# EAGLE design Main_board (EAGLE 6.3)
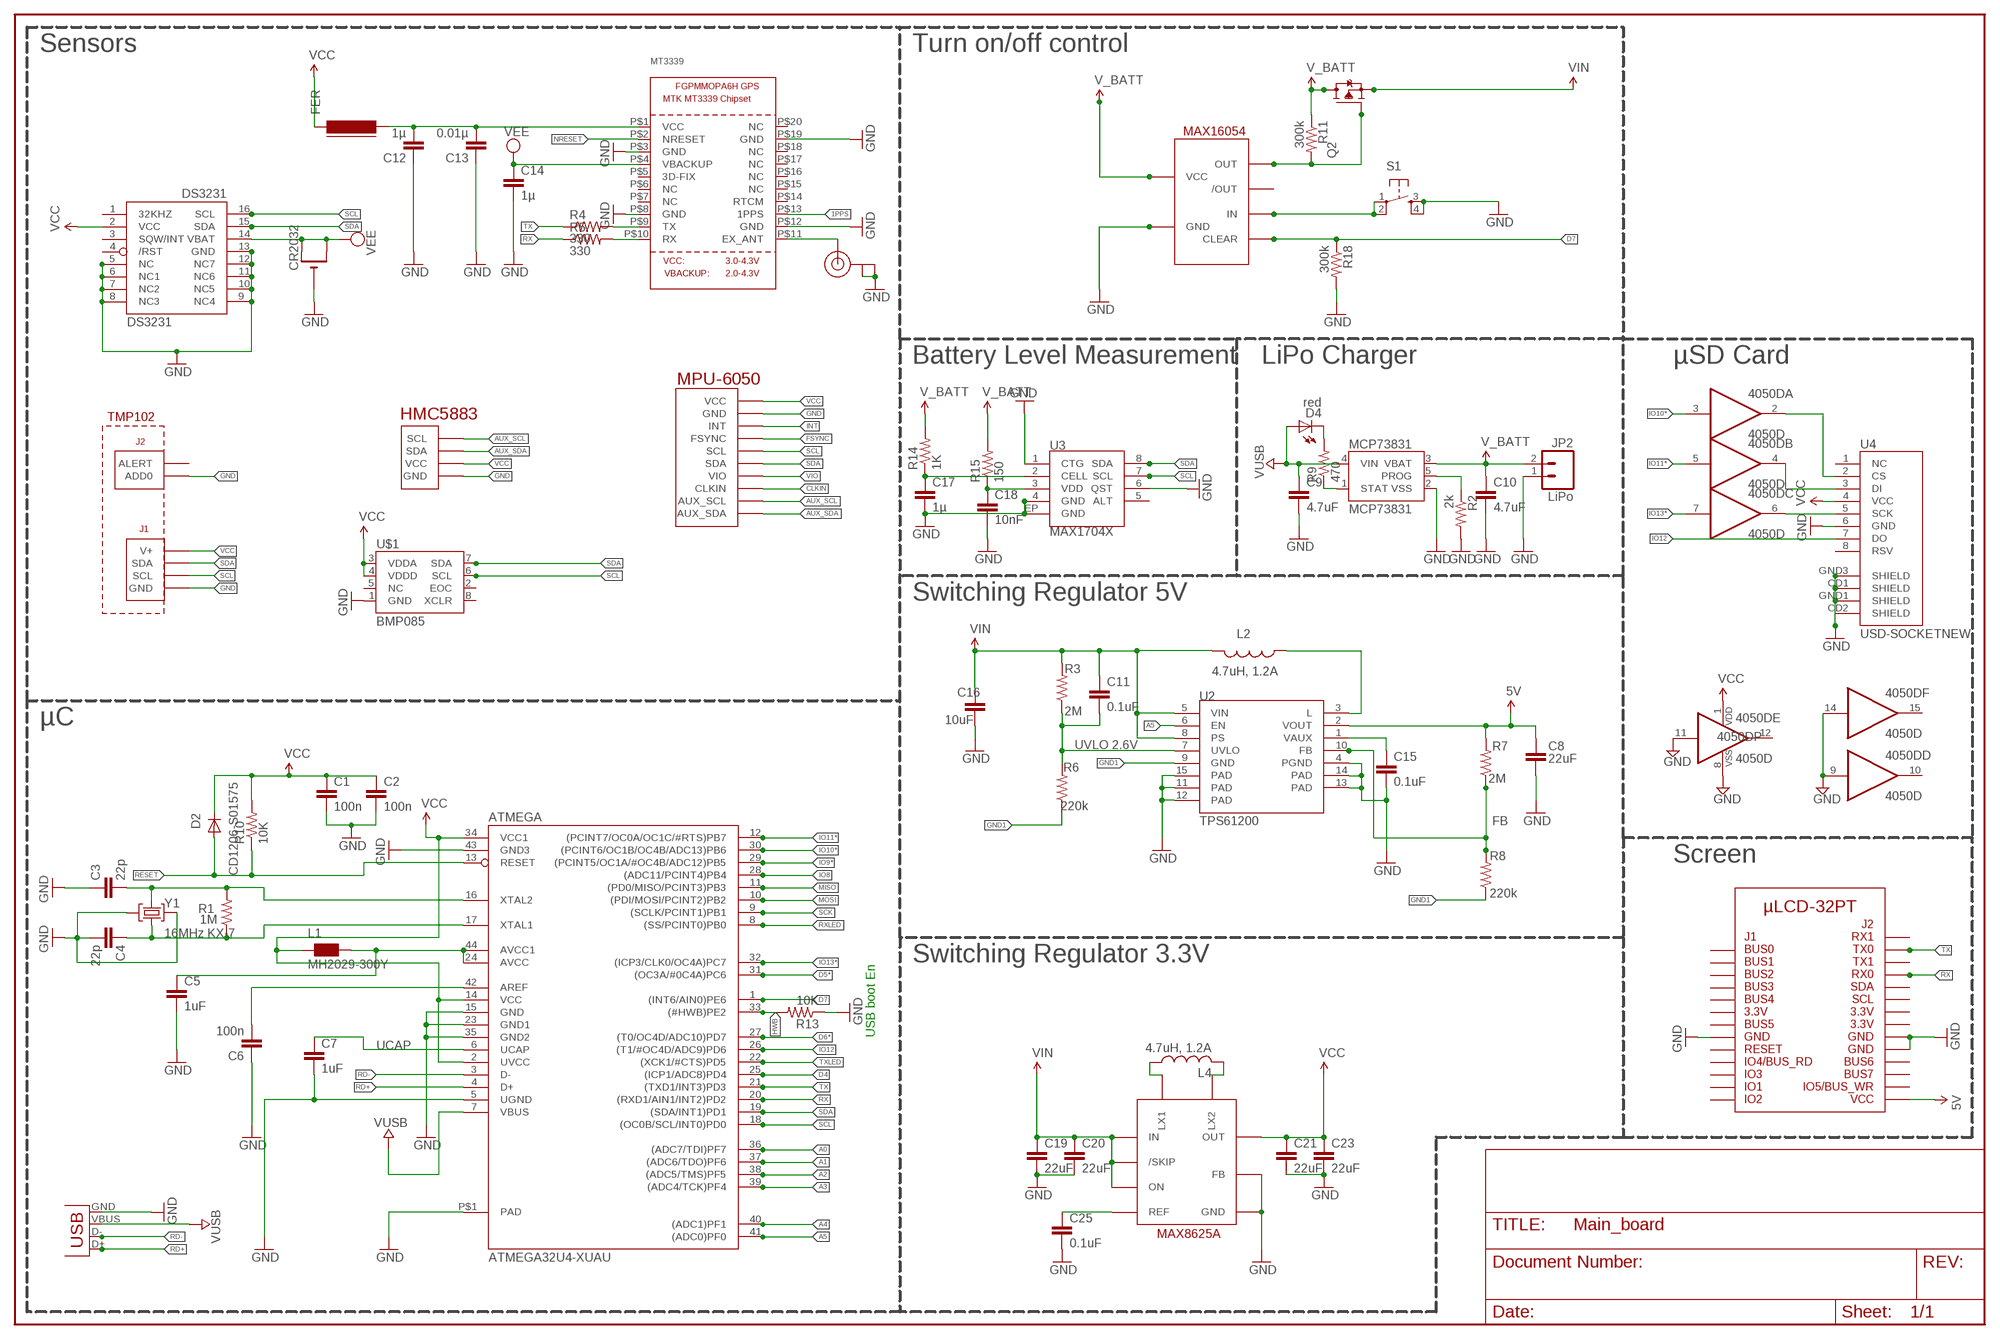
[diagram p0: schematic, sheet 1]

## Parts
4050D  4050D  [SO16]
ATMEGA  ATMEGA32U4-XUAU  [TQFP44-PAD]
C1  100n  CAP0805  [0805]
C2  100n  CAP0805  [0805]
C3  22p  CAP0805  [0805]
C4  22p  CAP0805  [0805]
C5  1uF  CAP0805  [0805]
C6  100n  CAP0805  [0805]
C7  1uF  CAP0805  [0805]
C8  22uF  CAP0805  [0805]
C9  4.7uF  CAP0805  [0805]
C10  4.7uF  CAP0805  [0805]
C11  0.1uF  CAP0805  [0805]
C12  1µ  CAP0805  [0805]
C13  0.01µ  CAP0805  [0805]
C14  1µ  CAP0805  [0805]
C15  0.1uF  CAP0805  [0805]
C16  10uF  CAP0805  [0805]
C17  1µ  CAP0805  [0805]
C18  10nF  CAP0805  [0805]
C19  22uF  CAP0805  [0805]
C20  22uF  CAP0805  [0805]
C21  22uF  CAP0805  [0805]
C23  22uF  CAP0805  [0805]
C25  0.1uF  CAP0805  [0805]
CR2032  CR2032SMT  [CR2032-SMD]
D2  CD1206-S01575  DIODE-MINIMELF  [MINIMELF]
D4  red  LED1206  [LED-1206]
DS3231  DS3231/SO  [SO16W]
FER  FERRITE-1206  [FB1206]
JP2  LiPo  M02-JST-2MM-SMT  [JST-2-SMD]
L1  MH2029-300Y  WE-CBF_0805  [0805]
L2  4.7uH, 1.2A  L-US  [2520]
L4  4.7uH, 1.2A  L-US  [2520]
MAX16054  MAX16054  [SOT23-6L]
MCP73831  MCP73831  [SOT23-5]
MT3339  GPS_FGPMMOPA6H  [FGPMMOPA6H]
Q2  TRANSISTOR_FET_TSM2301CX  [SOT-23]
R1  1M  RESISTOR0805-RES  [0805]
R2  2k  RESISTOR0805-RES  [0805]
R3  2M  RESISTOR0805-RES  [0805]
R4  330  RESISTOR0805-RES  [0805]
R5  330  RESISTOR0805-RES  [0805]
R6  220k  RESISTOR0805-RES  [0805]
R7  2M  RESISTOR0805-RES  [0805]
R8  220k  RESISTOR0805-RES  [0805]
R9  470  RESISTOR0805-RES  [0805]
R10  10K  RESISTOR0805-RES  [0805]
R11  300k  RESISTOR0805-RES  [0805]
R13  10K  RESISTOR0805-RES  [0805]
R14  1K  RESISTOR0805-RES  [0805]
R15  150  RESISTOR0805-RES  [0805]
R18  300k  RESISTOR0805-RES  [0805]
S1  TAC_SWITCHSMD  [TACTILE_SWITCH_SMD]
U2  TPS61200  [QFN-10_PAD]
U3  MAX1704X  [TDFN-8]
U4  USD-SOCKETNEW  [MICRO-SD-SOCKET-PP]
U$1  BMP085  [BMP085]
U$2  µLCD-32PT  [µLCD-32PT]
U$3  U.FL  [U.FL]
U$6  HMC5883  [HMC5883]
U$7  MPU-6050  [MPU-6050]
U$8  TMP102  [TMP102]
U$9  MAX8625A  [14-TDFN-EP]
X1  USB-MICROB  [USB-MICROB]
Y1  16MHz KX-7  CRYSTAL-3.2-2.5  [CRYSTAL-3.2-2.5]

## Nets
1PPS: MT3339.P$13(1PPS)
5V: C8.1 R7.2 U2.2(VOUT) U$2.J2-P6
A0: ATMEGA.36((ADC7/TDI)PF7)
A1: ATMEGA.37((ADC6/TDO)PF6)
A2: ATMEGA.38((ADC5/TMS)PF5)
A3: ATMEGA.39((ADC4/TCK)PF4)
A4: ATMEGA.40((ADC1)PF1)
A5: ATMEGA.41((ADC0)PF0) U2.6(EN)
AREF: ATMEGA.42(AREF) C6.2
AUX_SCL: U$6.SCL U$7.AUX_SCL
AUX_SDA: U$6.SDA U$7.AUX_SDA
AVCC: ATMEGA.24(AVCC) ATMEGA.44(AVCC1) C5.1 L1.2
CLKIN: U$7.CLK(CLKIN)
D4: ATMEGA.25((ICP1/ADC8)PD4)
D5*: ATMEGA.31((OC3A/#0C4A)PC6)
D6*: ATMEGA.27((T0/OC4D/ADC10)PD7)
D7: ATMEGA.1((INT6/AIN0)PE6) MAX16054.3(CLEAR) R18.1
FB: R7.1 R8.2 U2.10(FB)
FSYNC: U$7.FSYNC
GND: 4050D.8(P:VSS) 4050D.9(D:I) 4050D.11(E:I) 4050D.14(F:I) ATMEGA.5(UGND) ATMEGA.15(GND) ATMEGA.23(GND1) ATMEGA.35(GND2) ATMEGA.43(GND3) ATMEGA.P$1(PAD) C1.2 C2.2 C3.1 C4.2 C5.2 C6.1 C7.2 C8.2 C9.2 C10.2 C12.1 C13.1 C14.2 C15.2 C16.2 C17.2 C18.2 C19.2 C20.2 C21.2 C23.2 C25.2 CR2032.- DS3231.5(NC) DS3231.6(NC1) DS3231.7(NC2) DS3231.8(NC3) DS3231.9(NC4) DS3231.10(NC5) DS3231.11(NC6) DS3231.12(NC7) DS3231.13(GND) JP2.1 MAX16054.2(GND) MCP73831.2(VSS) MT3339.P$3(GND) MT3339.P$8(GND) MT3339.P$12(GND) MT3339.P$19(GND) R2.2 R13.1 R18.2 S1.3 S1.4 U2.4(PGND) U2.11(PAD) U2.12(PAD) U2.13(PAD) U2.14(PAD) U2.15(PAD) U3.1(CTG) U3.4(GND) U3.6(QST) U3.EP(GND) U4.6(GND) U4.CD1(SHIELD) U4.CD2(SHIELD) U4.GND1(SHIELD) U4.GND3(SHIELD) U$1.1(GND) U$2.J1-P15 U$2.J2-P15 U$2.J2-P17 U$3.P$1(GND) U$3.P$2(GND) U$6.GND U$7.GND U$8.ADD0 U$8.GND U$9.P$8(FB) U$9.P$12(GND) U$9.P$13(GND) X1.GND Y1.2(GND) Y1.4(GND)
GND1: R6.1 R8.1 U2.9(GND)
HWB: ATMEGA.33((#HWB)PE2) R13.2
INT: U$7.INT
IO8: ATMEGA.28((ADC11/PCINT4)PB4)
IO9*: ATMEGA.29((PCINT5/OC1A/#OC4B/ADC12)PB5)
IO10*: 4050D.3(A:I) ATMEGA.30((PCINT6/OC1B/OC4B/ADC13)PB6)
IO11*: 4050D.5(B:I) ATMEGA.12((PCINT7/OC0A/OC1C/#RTS)PB7)
IO12: ATMEGA.26((T1/#OC4D/ADC9)PD6) U4.7(DO)
IO13*: 4050D.7(C:I) ATMEGA.32((ICP3/CLK0/OC4A)PC7)
MISO: ATMEGA.11((PD0/MISO/PCINT3)PB3)
MOSI: ATMEGA.10((PDI/MOSI/PCINT2)PB2)
N$1: MT3339.P$11(EX_ANT) U$3.P$3(SIGNAL)
N$2: D4.C R9.2
N$3: L2.P$1 U2.3(L)
N$4: C15.1 U2.1(VAUX)
N$5: C17.1 R14.1 U3.2(CELL)
N$6: 4050D.4(B:O) U4.3(DI)
N$7: MT3339.P$9(TX) R4.2
N$8: MT3339.P$10(RX) R5.2
N$9: C12.2 C13.2 FER.2 MT3339.P$1(VCC)
N$10: C18.1 R15.1 U3.3(VDD)
N$11: MCP73831.5(PROG) R2.1
N$12: 4050D.6(C:O) U4.5(SCK)
N$13: 4050D.2(A:O) U4.2(CS)
N$14: MCP73831.1(STAT) R9.1
N$15: MAX16054.1(IN) S1.1 S1.2
N$22: C25.1 U$9.P$9(REF)
N$23: L4.P$1 U$9.P$2(LX1) U$9.P$3(LX1)
N$24: L4.P$2 U$9.P$4(LX2) U$9.P$5(LX2)
NRESET: MT3339.P$2(NRESET)
RD+: ATMEGA.4(D+) X1.D+
RD-: ATMEGA.3(D-) X1.D-
RESET: ATMEGA.13(RESET) D2.A R10.1
RX: ATMEGA.20((RXD1/AIN1/INT2)PD2) R5.1 U$2.J2-P27
RXLED: ATMEGA.8((SS/PCINT0)PB0)
SCK: ATMEGA.9((SCLK/PCINT1)PB1)
SCL: ATMEGA.18((OC0B/SCL/INT0)PD0) DS3231.16(SCL) U3.7(SCL) U$1.6(SCL) U$7.SCL U$8.SCL
SDA: ATMEGA.19((SDA/INT1)PD1) DS3231.15(SDA) U3.8(SDA) U$1.7(SDA) U$7.SDA U$8.SDA
TX: ATMEGA.21((TXD1/INT3)PD3) R4.1 U$2.J2-P29
TXLED: ATMEGA.22((XCK1/#CTS)PD5)
UCAP: ATMEGA.6(UCAP) C7.1
UVLO: C11.2 R3.1 R6.2 U2.7(UVLO)
V_BATT: C10.1 JP2.2 MAX16054.6(VCC) MCP73831.3(VBAT) Q2.3(D) R11.1 R14.2 R15.2
V_CTRL: MAX16054.5(OUT) Q2.1(G) R11.2
VCC: 4050D.1(P:VDD) ATMEGA.2(UVCC) ATMEGA.14(VCC) ATMEGA.34(VCC1) C1.1 C2.1 C21.1 C23.1 D2.C DS3231.2(VCC) FER.1 L1.1 R10.2 U4.4(VCC) U$1.3(VDDA) U$1.4(VDDD) U$6.VCC U$7.VDD(VCC) U$8.V+ U$9.P$10(OUT) U$9.P$11(OUT)
VEE: C14.1 CR2032.+$1(+) CR2032.+$2(+1) DS3231.14(VBAT) MT3339.P$4(VBACKUP)
VIN: C11.1 C16.1 C19.1 C20.1 L2.P$2 Q2.2(S) R3.2 U2.5(VIN) U2.8(PS) U$9.P$6(ON) U$9.P$7(/SKIP) U$9.P$14(IN) U$9.P$15(IN)
VIO: U$7.VIO
VUSB: ATMEGA.7(VBUS) C9.1 D4.A MCP73831.4(VIN) X1.VBUS
XTAL1: ATMEGA.17(XTAL1) C4.1 R1.1 Y1.1(C1)
XTAL2: ATMEGA.16(XTAL2) C3.2 R1.2 Y1.3(C2)
Unconnected: 4050D.10(D:O) 4050D.12(E:O) 4050D.15(F:O) DS3231.1(32KHZ) DS3231.3(SQW/INT) DS3231.4(/RST) MAX16054.4(/OUT) MT3339.P$5(3D-FIX) MT3339.P$6(NC) MT3339.P$7(NC) MT3339.P$14(RTCM) MT3339.P$15(NC) MT3339.P$16(NC) MT3339.P$17(NC) MT3339.P$18(NC) MT3339.P$20(NC) U3.5(ALT) U4.1(NC) U4.8(RSV) U$1.2(EOC) U$1.5(NC) U$1.8(XCLR) U$2.J1-P1 U$2.J1-P2 U$2.J1-P3 U$2.J1-P5 U$2.J1-P14 U$2.J1-P17 U$2.J1-P19 U$2.J1-P21 U$2.J1-P23 U$2.J1-P25 U$2.J1-P27 U$2.J2-P9 U$2.J2-P11 U$2.J2-P13 U$2.J2-P21 U$2.J2-P23 U$2.J2-P28 U$2.J2-P30 U$8.ALT(ALERT)

## Notes on the sheet
- Sensors | Turn on/off control
- Battery Level Measurement | LiPo Charger | µSD Card
- Switching Regulator 5V
- µC
- UVLO 2.6V
- Screen
- Switching Regulator 3.3V
- USB boot En

## Power pins joined to a net without a drawn wire
J1-P18: U$2.J1-P18
J2-P16: U$2.J2-P16
J2-P18: U$2.J2-P18

## Library data of the parts
4050D = 40xx:4050: Hex non-inverting BUFFER
ATMEGA = SmartPrj:ATMEGA32U4-XU
C1-C21 C23 C25 = SparkFun:CAP: Capacitor Standard 0603 ceramic capacitor, and 0.1" leaded capacitor.
CR2032 = adafruit:CR2032
D2 = diode:DIODE-: DIODE
D4 = SparkFun:LED: LEDs Standard schematic elements and footprints for 5mm, 3mm, 1206, and 0603 sized LEDs. 5mm - Spark Fun Electronics SKU : COM-00529 (and others)
DS3231 = adafruit:DS3231
FER = dp_devices:FERRITE: Ferrite bead in various packages
JP2 = SparkFun:M02: Header 2 Standard 2-pin 0.1" header. Use with straight break away headers (SKU : PRT-00116), right angle break away headers (PRT-00553), swiss pins (PRT-00743), machine pins (PRT-00117), and female headers (PRT-00115). Molex polarized connector foot print use with SKU : PRT-08233 with associated crimp pins and housings.
L1 = wuerth-elektronik:WE-CBF: SMD EMI Suppression Ferrite Beads - excellent anti-EMI properties - low DCR - impedances till 3000 ohms - rated current up to 6 A
L2 L4 = rcl:L-US: INDUCTOR, American symbol
MAX16054 = maxim:MAX16054
MCP73831 = SparkFun:MCP73831: Microchip's MCP73831 Miniature single cell, fully integrated Li-Ion, Li-polymer charge management controller http://ww1.microchip.com/downloads/en/DeviceDoc/21984a.pdf
MT3339 = adafruit:GPS_FGPMMOPA6H: GPS Module - MTK MT3339 Chipset, -165dBm sensitivity, 22 channels, 10Hz, auto-select external antenna options
Q2 = dp_devices:TRANSISTOR_FET_TSM2301CX: 20V P-Channel Enhancement Mode MOSFET
R1-R10 R13-R15 = SparkFun:RESISTOR: Resistor Basic schematic elements and footprints for 0603, 1206, and PTH resistors.
R11 R18 = SparkFun-Passives:RESISTOR: Resistor Basic schematic elements and footprints for 0603, 1206, and PTH resistors.
S1 = SparkFun-Electromechanical:TAC_SWITCH: Momentary Switch Button commonly used for reset or general input. Spark Fun Electronics SKU : COM-00097 SMT- SWCH-08247; PROD_ID: SWCH-08247
U2 = SparkFun:TPS61200: DC to DC Booster
U3 = SparkFun-PowerIC:MAX1704X: MAX17043/MAX17044: Battery Fuel Guage (43 is 1cell, 44 is 2cell)
U4 = SparkFun-Connectors:USD-SOCKET: microSD Socket Push-push type uSD socket. Schematic element and footprint production proven. Spark Fun Electronics SKU : PRT-00127. tDoc lines correctly indicate media card edge positions when inserting (unlocked, locked, depressed).
U$1 = SparkFun:BMP085: BMP085 Pressure Sensor Great little MEMS pressure sensor. SKU: COM-09603
U$2 = 4DSystems:µLCD-32PT
U$3 = SparkFun:U.FL
U$6 = SparkFun-Breakouts:HMC5883: HMC5883 On breakout from SparkFun SFU:SEN-10530
U$7 = SparkFun-Breakouts:MPU-6050: MPU-6050 Breakout board from SparkFun SFU:SEN-11028
U$8 = SparkFun-Breakouts:TMP102: TMP102 Breakout from SparkFun SFU:SEN-09418
U$9 = maxim:MAX8625A: High-Efficiency, Seamless Transition, Step-Up/Down DC-DC Converter
X1 = SparkFun:USB: USB Connectors USB-B-PTH is fully proven SKU : PRT-00139 USB-miniB is fully proven SKU : PRT-00587 USB-A-PCB is untested. USB-A-H is throughly reviewed, but untested. Spark Fun Electronics SKU : PRT-00437 USB-B-SMT is throughly reviewed, but untested. Needs silkscreen touching up. USB-A-S has not been used/tested USB-MB-H has not been used/tested
Y1 = SmartPrj:CRYSTAL-3.2-2.5

## Board
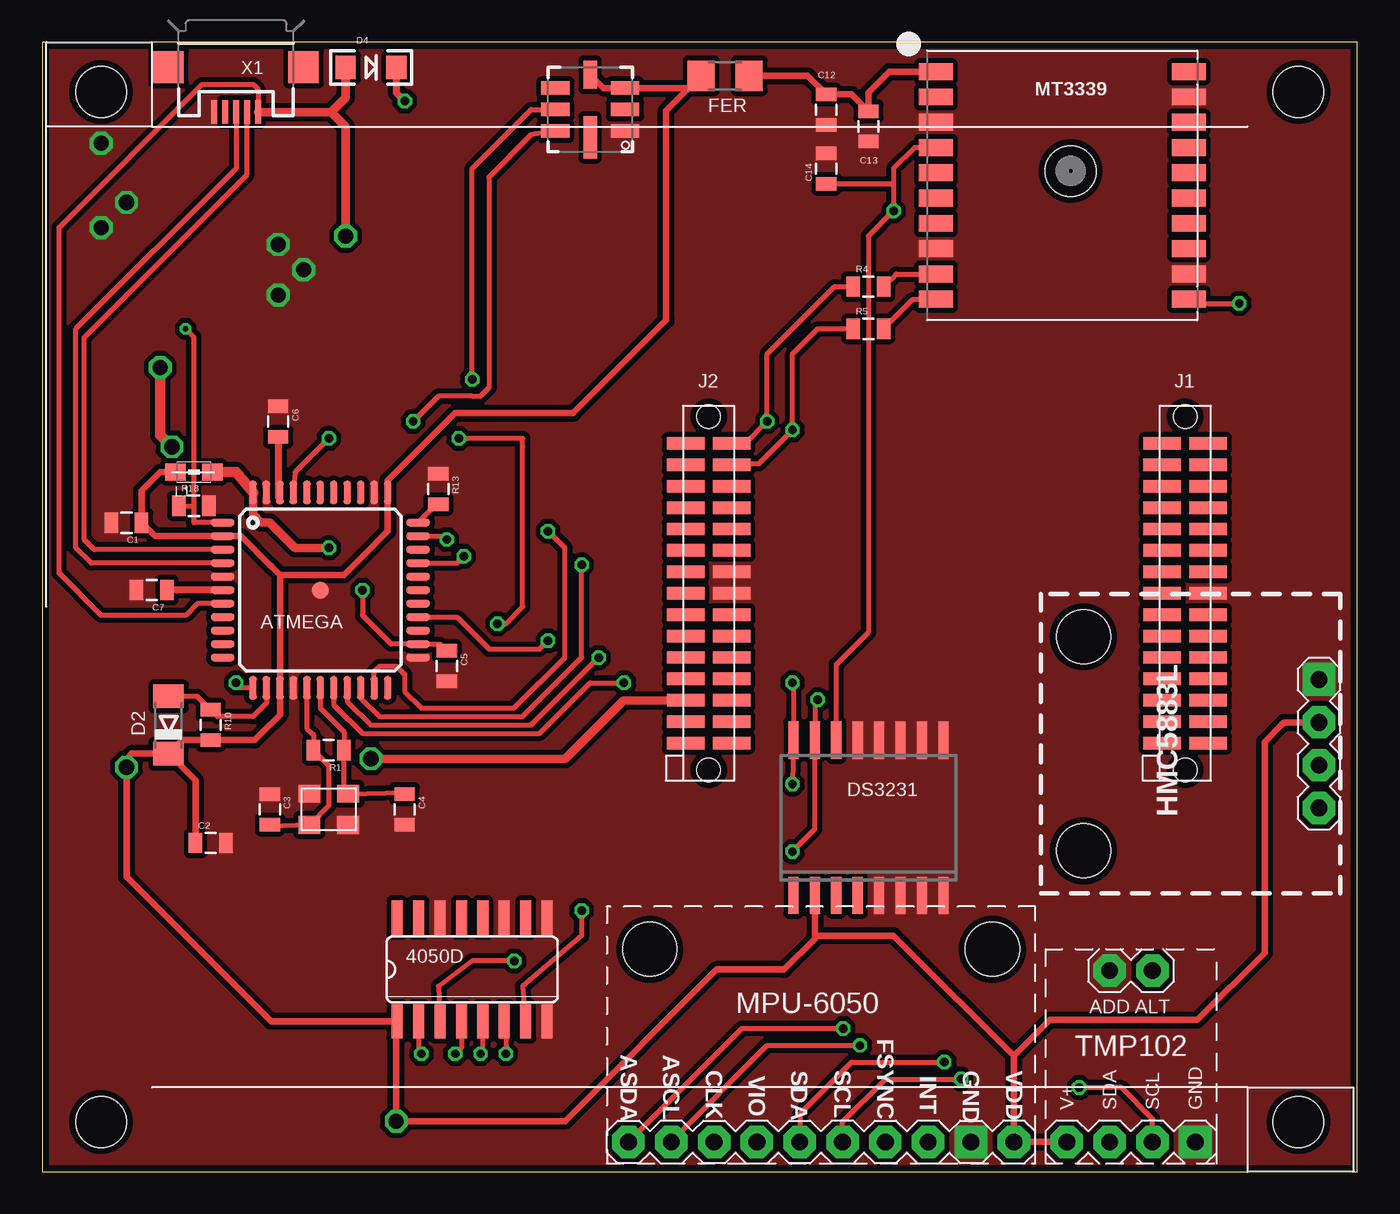
[diagram p1: board, top side]
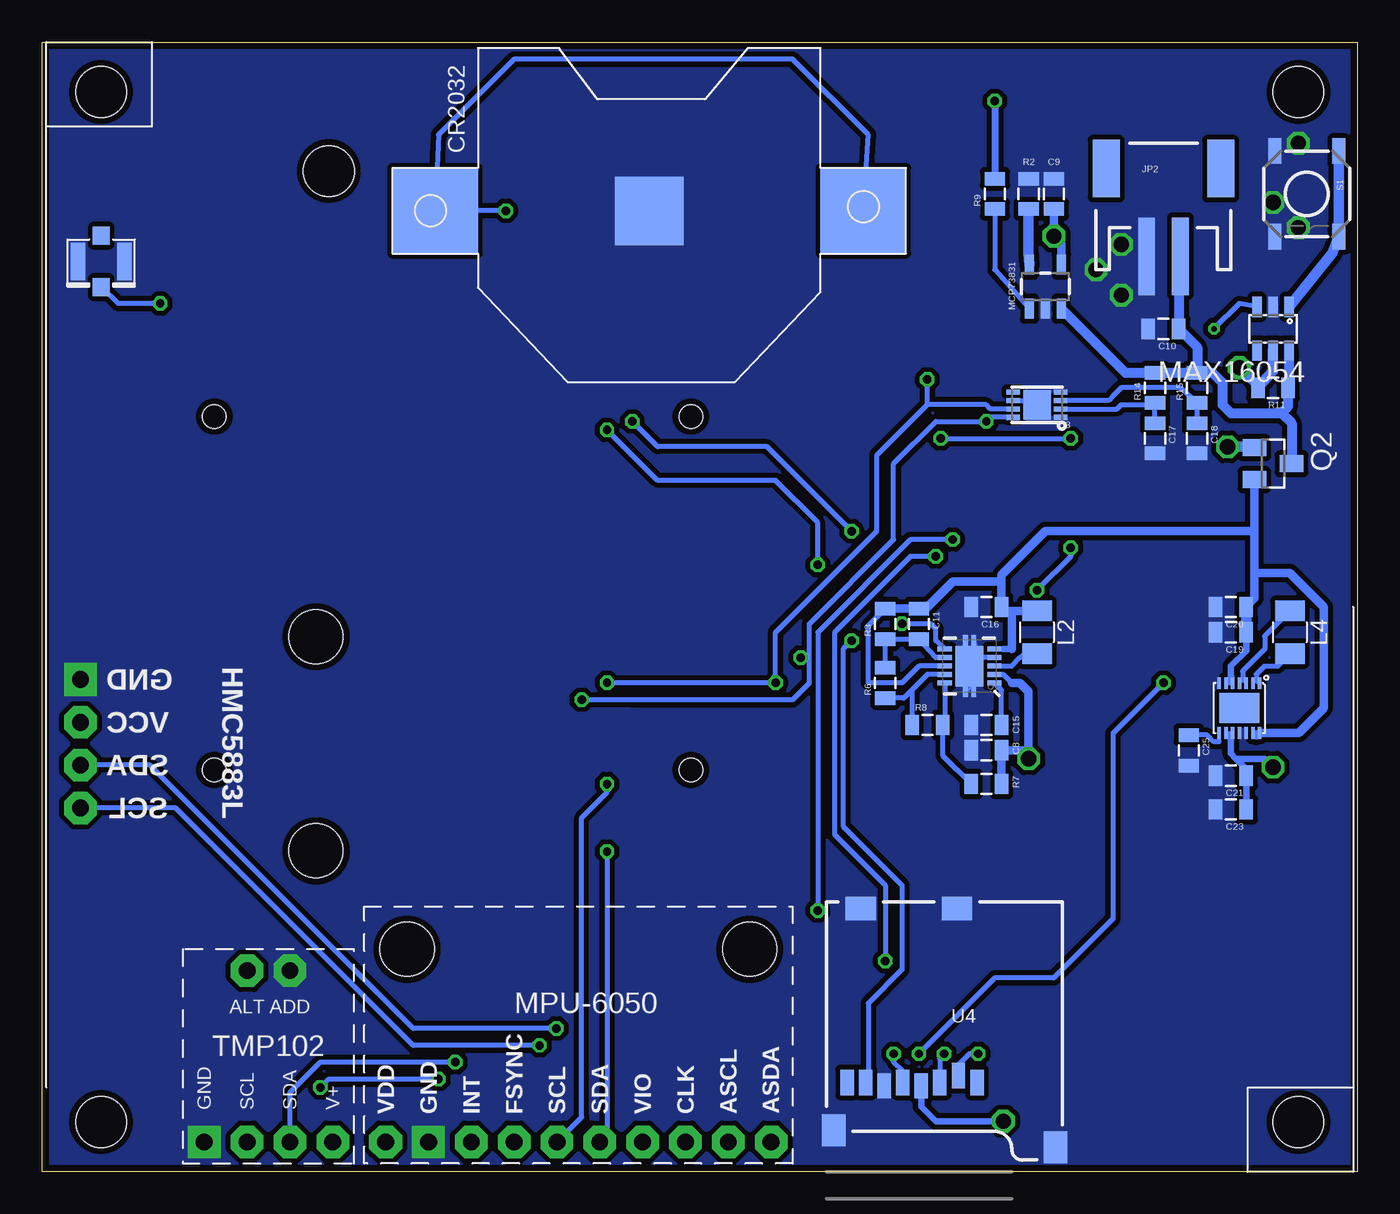
[diagram p2: board, bottom side, seen from below]

Size 78 x 67 mm. Coordinates in mm from the lower left corner, seen from the top.
Outline: 0,0 78,0 78,67 0,67 0,0
Copper layers (1*16): Top 0.0356mm / dielectric 1.5011mm / Bottom 0.0356mm
Design rules "LaenPCBOrder": minimum track width 6mil, minimum drill 13mil, track to track 6mil, track to pad 6mil, pad to pad 6mil, via to via 6mil, smd to smd 6mil, copper to edge 15mil, drill to drill 6mil, minimum pad ring 7mil, minimum via ring 7mil, stop-mask expansion 4mil, vias tented up to drill 0mil, thermal gap 10mil

### Footprints (pad centres in the part's own frame; a part is rotated, then mirrored left to right if it is on the bottom)
SO16 = smd 0.66 x 2.032: 1 -4.445,-3.073; 2 -3.175,-3.073; 3 -1.905,-3.073; 4 -0.635,-3.073; 5 0.635,-3.073; 6 1.905,-3.073; 7 3.175,-3.073; 8 4.445,-3.073; 9 4.445,3.073; 10 3.175,3.073; 11 1.905,3.073; 12 0.635,3.073; 13 -0.635,3.073; 14 -1.905,3.073; 15 -3.175,3.073; 16 -4.445,3.073
TQFP44-PAD = smd 1.4 x 0.45: 1 -5.8,4; 2 -5.8,3.2; 3 -5.8,2.4; 4 -5.8,1.6; 5 -5.8,0.8; 6 -5.8,0; 7 -5.8,-0.8; 8 -5.8,-1.6; 9 -5.8,-2.4; 10 -5.8,-3.2; 11 -5.8,-4; 23 5.8,-4; 24 5.8,-3.2; 25 5.8,-2.4; 26 5.8,-1.6; 27 5.8,-0.8; 28 5.8,0; 29 5.8,0.8; 30 5.8,1.6; 31 5.8,2.4; 32 5.8,3.2; 33 5.8,4 | smd 0.45 x 1.4: 12 -4,-5.8; 13 -3.2,-5.8; 14 -2.4,-5.8; 15 -1.6,-5.8; 16 -0.8,-5.8; 17 0,-5.8; 18 0.8,-5.8; 19 1.6,-5.8; 20 2.4,-5.8; 21 3.2,-5.8; 22 4,-5.8; 34 4,5.8; 35 3.2,5.8; 36 2.4,5.8; 37 1.6,5.8; 38 0.8,5.8; 39 0,5.8; 40 -0.8,5.8; 41 -1.6,5.8; 42 -2.4,5.8; 43 -3.2,5.8; 44 -4,5.8 | smd 1 x 1: P$1 0,0
0805 = smd 0.8 x 1.2: 1 -0.9,0; 2 0.9,0
CR2032-SMD = smd 5.08 x 5.08: +$1 -12.7,0; +$2 12.7,0 | smd 4.064 x 4.064: - 0,0
MINIMELF = smd 1.4 x 1.8: A 1.7,0; C -1.7,0
LED-1206 = smd 1.2 x 1.4: A -1.5,0; C 1.5,0
SO16W = smd 0.6 x 2.2: 1 -4.445,-4.6; 2 -3.175,-4.6; 3 -1.905,-4.6; 4 -0.635,-4.6; 5 0.635,-4.6; 6 1.905,-4.6; 7 3.175,-4.6; 8 4.445,-4.6; 9 4.445,4.6; 10 3.175,4.6; 11 1.905,4.6; 12 0.635,4.6; 13 -0.635,4.6; 14 -1.905,4.6; 15 -3.175,4.6; 16 -4.445,4.6
FB1206 = smd 1.6 x 1.803: 1 -1.422,0; 2 1.422,0
JST-2-SMD = smd 1 x 4.6: 1 -1,-3.7; 2 1,-3.7 | smd 1.6 x 3.4: NC1 -3.4,1.5; NC2 3.4,1.5
0805' = smd 1.2 x 1: 1 -1.1,0; 2 1.1,0
2520 = smd 1.2 x 1.75: P$1 1.275,0; P$2 -1.275,0
SOT23-6L = smd 0.55 x 1.2: 1 -0.95,-1.3; 2 0,-1.3; 3 0.95,-1.3; 4 0.95,1.3; 5 0,1.3; 6 -0.95,1.3
SOT23-5 = smd 0.55 x 1.2: 1 -0.95,-1.3; 2 0,-1.3; 3 0.95,-1.3; 4 0.95,1.3; 5 -0.95,1.3
FGPMMOPA6H = smd 2 x 1: P$1 -7.5,6.75; P$2 -7.5,5.25; P$3 -7.5,3.75; P$4 -7.5,2.25; P$5 -7.5,0.75; P$6 -7.5,-0.75; P$7 -7.5,-2.25; P$8 -7.5,-3.75; P$9 -7.5,-5.25; P$10 -7.5,-6.75; P$11 7.5,-6.75; P$12 7.5,-5.25; P$13 7.5,-3.75; P$14 7.5,-2.25; P$15 7.5,-0.75; P$16 7.5,0.75; P$17 7.5,2.25; P$18 7.5,3.75; P$19 7.5,5.25; P$20 7.5,6.75 | hole 3: 0.5,0.85
SOT-23 = smd 1 x 1.4: 1 -0.95,-1.1; 2 0.95,-1.1; 3 0,1.1
TACTILE_SWITCH_SMD = smd 1.524 x 0.762: 1 -2.54,1.905; 2 2.54,1.905; 3 -2.54,-1.905; 4 2.54,-1.905
QFN-10_PAD = smd 0.297 x 0.85: 1 -1,-1.475; 2 -0.5,-1.475; 3 0,-1.475; 4 0.5,-1.475; 5 1,-1.475; 6 1,1.475; 7 0.5,1.475; 8 0,1.475; 9 -0.5,1.475; 10 -1,1.475 | smd 0.7 x 0.28: 11 -1.5,0.25; 12 -1.5,-0.25; 13 1.5,0.25; 14 1.5,-0.25 | smd 2.4 x 1.65: 15 0,0
TDFN-8 = smd 0.8 x 0.3: 1 -1.4,0.75; 2 -1.4,0.25; 3 -1.4,-0.25; 4 -1.4,-0.75; 5 1.4,-0.75; 6 1.4,-0.25; 7 1.4,0.25; 8 1.4,0.75 | smd 1.63 x 1.75: EP 0,0
MICRO-SD-SOCKET-PP = smd 0.8 x 1.5: 1 -8.94,10.7; 2 -7.84,10.3; 3 -6.74,10.7; 4 -5.64,10.9; 5 -4.54,10.7; 6 -3.44,10.9; 7 -2.34,10.7; 8 -1.24,10.7 | smd 1.8 x 1.4: CD1 -2.05,0.4; CD2 -7.75,0.4 | smd 1.4 x 1.9: GND1 -13.6,14.55; GND3 -0.45,13.55
BMP085 = smd 1.67 x 0.8: 1 -2.065,1.27; 2 -2.065,0; 3 -2.065,-1.27; 5 2.065,-1.27; 6 2.065,0; 7 2.065,1.27 | smd 0.8 x 1.67: 4 0,-2.065 | smd 0.8 x 2.5: 8 0,1.65
µLCD-32PT = smd 2.223 x 0.737: J1-P1 30.16,-8.075; J1-P2 27.43,-8.075; J1-P3 30.16,-6.805; J1-P4 27.43,-6.805; J1-P5 30.16,-5.535; J1-P6 27.43,-5.535; J1-P7 30.16,-4.265; J1-P8 27.43,-4.265; J1-P9 30.16,-2.995; J1-P10 27.43,-2.995; J1-P11 30.16,-1.725; J1-P12 27.43,-1.725; J1-P13 30.16,-0.455; J1-P14 27.43,-0.455; J1-P15 30.16,0.815; J1-P16 27.43,0.815; J1-P17 30.16,2.085; J1-P18 27.43,2.085; J1-P19 30.16,3.355; J1-P20 27.43,3.355; J1-P21 30.16,4.625; J1-P22 27.43,4.625; J1-P23 30.16,5.895; J1-P24 27.43,5.895; J1-P25 30.16,7.165; J1-P26 27.43,7.165; J1-P27 30.16,8.435; J1-P28 27.43,8.435; J1-P29 30.16,9.705; J1-P30 27.43,9.705; J2-P1 1.89,-8.075; J2-P2 -0.84,-8.075; J2-P3 1.89,-6.805; J2-P4 -0.84,-6.805; J2-P5 1.89,-5.535; J2-P6 -0.84,-5.535; J2-P7 1.89,-4.265; J2-P8 -0.84,-4.265; J2-P9 1.89,-2.995; J2-P10 -0.84,-2.995; J2-P11 1.89,-1.725; J2-P12 -0.84,-1.725; J2-P13 1.89,-0.455; J2-P14 -0.84,-0.455; J2-P15 1.89,0.815; J2-P16 -0.84,0.815; J2-P17 1.89,2.085; J2-P18 -0.84,2.085; J2-P19 1.89,3.355; J2-P20 -0.84,3.355; J2-P21 1.89,4.625; J2-P22 -0.84,4.625; J2-P23 1.89,5.895; J2-P24 -0.84,5.895; J2-P25 1.89,7.165; J2-P26 -0.84,7.165; J2-P27 1.89,8.435; J2-P28 -0.84,8.435; J2-P29 1.89,9.705; J2-P30 -0.84,9.705 | hole 3: 35.5,-30.55; 35.5,30.55; -35.5,30.55; -35.5,-30.55 | hole 1.397: 28.795,-9.662; 28.795,11.293; 0.525,-9.662; 0.525,11.293
U.FL = smd 2.2 x 0.85: P$1 0,1.375; P$2 0,-1.375 | smd 1.05 x 1: P$3 1.525,0; P$4 -1.525,0
HMC5883 = drill 1 pad 1.93 square: GND 12.7,1.27 | drill 1 pad 1.93 octagon: SCL 5.08,1.27; SDA 7.62,1.27; VCC 10.16,1.27 | hole 3.2: 2.54,15.24; 15.24,15.24
MPU-6050 = drill 1 pad 1.93 octagon: AUX_SCL 3.81,1.27; AUX_SDA 1.27,1.27; CLK 6.35,1.27; FSYNC 16.51,1.27; INT 19.05,1.27; SCL 13.97,1.27; SDA 11.43,1.27; VDD 24.13,1.27; VIO 8.89,1.27 | drill 1 pad 1.93 square: GND 21.59,1.27 | hole 3.2: 2.54,12.7; 22.86,12.7
TMP102 = drill 1 pad 1.93 octagon: ADD0 3.81,11.43; ALT 6.35,11.43; SCL 6.35,1.27; SDA 3.81,1.27; V+ 1.27,1.27 | drill 1 pad 1.93 square: GND 8.89,1.27
14-TDFN-EP = smd 1.78 x 2.35: P$1 0,0 | smd 0.7 x 0.2: P$2 -1.475,1.205; P$3 -1.475,0.805; P$4 -1.475,0.405; P$5 -1.475,0.005; P$6 -1.475,-0.395; P$7 -1.475,-0.795; P$8 -1.475,-1.195; P$9 1.48,-1.195; P$10 1.48,-0.795; P$11 1.48,-0.395; P$12 1.48,0.005; P$13 1.48,0.405; P$14 1.48,0.805; P$15 1.48,1.205
USB-MICROB = smd 0.35 x 1.4: D+ 0,2.65; D- -0.65,2.65; GND 1.3,2.65; ID 0.65,2.65; VBUS -1.3,2.65 | smd 1.8 x 1.9: MT1 -4,0; MT2 4,0
CRYSTAL-3.2-2.5 = smd 1.3 x 1.05: 1 -1.15,-0.925; 2 1.15,-0.925; 3 1.15,0.925; 4 -1.15,0.925

### Placement (x,y rotation side)
4050D  25.5,12 0 top
ATMEGA  16.5,34.5 0 top
C1  5,38.5 180 top
C2  10,19.5 0 top
C3  13.5,21.5 270 top
C4  21.5,21.5 270 top
C5  24,30 270 top
C6  14,44.5 270 top
C7  6.5,34.5 180 top
C8  22,25 180 bottom
C9  18,58 90 bottom
C10  11.5,50 180 bottom
C11  26,32.5 270 bottom
C12  46.5,63 90 top
C13  49,62 90 top
C14  46.5,59.5 90 top
C15  22,26.5 180 bottom
C16  22,33.5 180 bottom
C17  12,43.5 270 bottom
C18  9.5,43.5 270 bottom
C19  7.5,32 180 bottom
C20  7.5,33.5 180 bottom
C21  7.5,23.5 180 bottom
C23  7.5,21.5 180 bottom
C25  10,25 270 bottom
CR2032  42,57 0 bottom
D2  7.5,26.5 90 top
D4  19.5,65.5 0 top
DS3231  49,21 0 top
FER  40.5,65 0 top
JP2  11.5,58 0 bottom
L1  MH2029-300Y  [0805']  9,41.5 0 top
L2  19,32 270 bottom
L4  4,32 270 bottom
MAX16054  5,50 180 bottom
MCP73831  18.5,52.5 0 bottom
MT3339  60.5,58.5 0 top
Q2  5,42 270 bottom
R1  17,25 180 top
R2  19.5,58 90 bottom
R3  28,32.5 90 bottom
R4  49,52.5 0 top
R5  49,50 0 top
R6  28,29 90 bottom
R7  22,23 0 bottom
R8  25.5,26.5 0 bottom
R9  21.5,58 90 bottom
R10  10,26.5 270 top
R11  5,46.5 180 bottom
R13  23.5,40.5 270 top
R14  12,46.5 90 bottom
R15  9.5,46.5 90 bottom
R18  9,39.5 0 top
S1  3,58 270 bottom
U2  23,30 90 bottom
U3  19,45.5 180 bottom
U4  31.5,16 180 bottom
U$1  32.5,63 180 top
U$2  39,33.5 0 top
U$3  74.5,54 270 bottom
U$6  77,16.5 90 top
U$7  33.5,0.5 0 top
U$8  59.5,0.5 0 top
U$9  7,27.5 270 bottom
X1  11.5,65.5 180 top
Y1  17,21.5 180 top

### Tracks (layer width: path | path; a pad name or v marks a point on that pad's centre or on a via)
5V  (via drill 0.9)
  Top 0.5: U$2.J2-P6 34.47,27.96 31,24.5 v19.5,24.5
  Bottom 0.3: U2.2 21,29.5 20.5,29
  Bottom 0.5: v19.5,24.5 19.5,25 | 19.5,25 19.5,28.5 20,29 20.5,29 | 19.5,25 C8.1 R7.2
A5  (via drill 0.5)
  Top 0.3: v27,32.5 27.5,32.5 28.5,33.5
  Top 0.305: 28.5,33.5 28.5,43 28.5,43.5 v24.7,43.5 | v17,43.5 15,41.5 ATMEGA.41
  Bottom 0.3: 25.3,32.5 v27,32.5
  Bottom 0.305: U2.6 25,31.5 25,32.2 25.3,32.5 | v24.7,43.5 v17,43.5
AREF
  Top 0.406: C6.2 14,40 ATMEGA.42
AUX_SCL  (via drill 0.5)
  Top 0.305: U$7.AUX_SCL 43,7.5 v48.5,7.5
  Bottom 0.3: 56,7.5 70.08,21.58 U$6.SCL
  Bottom 0.305: v48.5,7.5 56,7.5
AUX_SDA  (via drill 0.5)
  Top 0.305: U$7.AUX_SDA 41.5,8.5 v47.5,8.5
  Bottom 0.3: 56,8.5 71.62,24.12 U$6.SDA
  Bottom 0.305: v47.5,8.5 56,8.5
AVCC  (via drill 0.5)
  Top 0.3: C5.1 23.6,31.3 ATMEGA.24 20.7,31.3 19,33
  Top 0.305: v19,34.5 19,33
  Top 0.5: ATMEGA.44 12.5,39 13,38.5 13.5,38.5 15,37 v17,37
  Top 0.61: L1.2 11.5,41.5 ATMEGA.44
  Bottom 0.305: v17,37 17,36.5 v19,34.5
D7  (via drill 0.33)
  Top 0.305: ATMEGA.1 9,38.5 9,39.5 | v8.5,50 9,49.5 9,39.5 | R18.1 9,39.5
  Bottom 0.305: MAX16054.3 7,51.5 v8.5,50
FB
  Bottom 0.3: U2.10 24.48,26.62 R8.2 24.6,24.7 R7.1
GND  (via drill 0.9)
  Bottom 0.254: U2.14 22.5,30.5 | 22.5,30.5 U2.15 | 22.5,30.5 22.5,29 U2.11
  Bottom 0.3: U3.6 19.25,45.75 U3.EP
  Bottom 0.305: U2.4 22.5,30.5
  other vias: 5,57.5 3.5,56 14,55 15.5,53.5 14,52 3.5,61
  pour Top (isolate 0.3, no thermals): 0,0 78,0 78,67 0,67
  pour Bottom (isolate 0.3, no thermals): 0,0 78,0 78,67 0,67
GND1
  Bottom 0.3: U2.9 25.5,29.5 26,29 | 26,29 26.5,28.5 26.9,28.1 R6.1 | R8.1 26.4,28.6 26,29
HWB
  Top 0.3: ATMEGA.33 23.4,39.6 R13.2
  Top 0.406: R13.2 23.5,39.5
IO10*  (via drill 0.5)
  Top 0.3: ATMEGA.30 24.6,36.1 v25,36.5
  Top 0.305: v28,12.5 25.5,12.5 23.5,11 4050D.3
  Bottom 0.305: v25,36.5 26.5,36.5 31,32 31,20 28,17 v28,12.5
IO11*  (via drill 0.5)
  Top 0.3: ATMEGA.12 11.8,28.7 v11.5,29 | v26,7 26.14,7.13 4050D.5
  Bottom 0.3: 14.5,26 v11.5,29 | 21.5,11.5 v26,7
  Bottom 0.305: 14.5,26 14.5,15 18,11.5 21.5,11.5
IO12  (via drill 0.5)
  Top 0.3: ATMEGA.26 24.6,32.9 26.5,31 28,31 29.5,31 v30,31.5
  Bottom 0.3: v30,31.5 30.5,31 30.5,20.5
  Bottom 0.305: 30.5,20.5 27,17 27,12 29,10 29,5.5 U4.7
IO13*  (via drill 0.5)
  Top 0.3: ATMEGA.32 23.8,37.7 v24,37.5
  Top 0.305: v32,15.5 32,14 28.5,11 4050D.7
  Bottom 0.305: v24,37.5 26.5,37.5 32,32 v32,15.5
N$1  (via drill 0.5)
  Top 0.305: MT3339.P$11 68,51.5 v71,51.5
  Bottom 0.305: v71,51.5 73.5,51.5 U$3.P$3
N$2  (via drill 0.5)
  Top 0.406: D4.C 21,64 v21.5,63.5
  Bottom 0.406: v21.5,63.5 R9.2
N$3
  Bottom 0.3: U2.3 20.5,30 20,30.5 19.77,30.73 L2.P$1
  Bottom 0.305: L2.P$1 18.82,30.52
N$4
  Bottom 0.3: C15.1 21.1,28.57 U2.1
  Bottom 0.305: U2.1 21.5,29
N$5
  Bottom 0.3: U3.2 14.25,45.25 14,45.5 12.5,45.5
  Bottom 0.305: C17.1 R14.1 12.5,45.5
N$6  (via drill 0.5)
  Top 0.3: 4050D.4 24.86,7.37 v24.5,7
  Bottom 0.3: v24.5,7 24.76,6.74 U4.3
N$7
  Top 0.3: R4.2 50.65,53.25 MT3339.P$9
N$8
  Top 0.3: R5.2 51.65,51.75 MT3339.P$10
N$9
  Top 0.4: FER.2 45.4,65 C12.2 48,63.9 C13.2 49,64 50,65 50.25,65.25 MT3339.P$1
N$10
  Bottom 0.3: 14.5,46 14.75,45.75 U3.3
  Bottom 0.305: C18.1 R15.1 10.5,46.5 14,46.5 14.5,46
N$11
  Bottom 0.61: R2.1 19.5,54.5 MCP73831.5
N$12  (via drill 0.5)
  Top 0.3: 4050D.6 27.5,8.83 v27.5,7
  Bottom 0.3: U4.5 26.96,5.96 27.5,6.5 v27.5,7
N$13  (via drill 0.5)
  Top 0.3: 4050D.2 22.32,7.17 v22.5,7
  Bottom 0.3: v22.5,7 23,7 23.5,6.5 23.66,6.34 U4.2
N$14
  Bottom 0.305: R9.1 21.5,53.5 MCP73831.1
N$15
  Bottom 0.61: S1.1 S1.2 1.5,54.5 MAX16054.1
N$22
  Bottom 0.2: U$9.P$9 8.2,25.5
  Bottom 0.3: 8.2,25.5 8.5,25.5 8.9,25.9 C25.1
N$23
  Bottom 0.2: U$9.P$3 6,29.17 5.99,29.17 U$9.P$2
  Bottom 0.3: L4.P$1 4.72,30 5.5,30 6,29.5 6,29.18 U$9.P$2
N$24
  Bottom 0.2: 6.8,29.18 U$9.P$4 6.79,29.17 6.8,29.17 U$9.P$5
  Bottom 0.3: L4.P$2 5.5,31.77 5.5,31 6.8,29.7 6.8,29.17
RD+
  Top 0.3: X1.D+ 11.5,59.5 2,50 | ATMEGA.4 2.9,36.1 2,37
  Top 0.305: 2,37 2,50
RD-
  Top 0.3: ATMEGA.3 3.1,36.9 2.5,37.5 2.5,49.51 2.51,49.51 12,59 12.15,59.15 X1.D-
RESET
  Top 0.3: ATMEGA.13 13.3,27.8 12.5,27 10.4,27 R10.1 9.2,28.2 D2.A
RX  (via drill 0.5)
  Top 0.3: ATMEGA.20 18.9,28.1 20,27 28.5,27 | R5.1 46,50 44.5,48.5 v44.5,44 42.5,42 41,42
  Top 0.305: 28.5,27 32,30.5 v32,36 | 41,42 U$2.J2-P27
  Bottom 0.3: 32,38 32,38.5 34.5,41 41.5,41 v44.5,44
  Bottom 0.305: v32,36 32,38
SCL  (via drill 0.5)
  Top 0.3: ATMEGA.18 17.3,27.7 19,26 29.5,26 32.5,29 | U$7.SCL 47.47,2.97 50,5.5 | v44.5,29 44.55,28.95 DS3231.16 | U$8.SCL 65.85,3.15 64,5 63,5
  Top 0.305: 32.5,29 v34.5,29 | v25.5,47 25.5,59.5 29,63 U$1.6 | DS3231.16 v44.5,23 | 50,5.5 v54.5,5.5 | v61.5,5 63,5
  Bottom 0.3: U3.7 21.75,45.25 22,45.5 25.5,45.5 | U$7.SCL 46,3.24 46,21 44.5,22.5 v44.5,23 | 43.5,29 v44.5,29 | 61,5.5 v61.5,5
  Bottom 0.305: v25.5,47 25.5,45.5 28.5,42.5 28.5,38 34.5,32 v34.5,29 43.5,29 | v54.5,5.5 61,5.5
SDA  (via drill 0.5)
  Top 0.3: ATMEGA.19 18.1,27.9 19.5,26.5 29,26.5 | v44.5,19 45.83,20.32 DS3231.15 45.83,27.82 v46,28 | 48,6.5 44.93,3.43 U$7.SDA | 25.5,46 26,46 26.5,46.5
  Top 0.305: U$1.7 29,61.5 26.5,59 26.5,46.5 | 25.5,46 23.5,46 v22,44.5 | 48,6.5 v53.5,6.5 | 29,26.5 v33,30.5
  Bottom 0.3: U3.8 21.75,44.75 v22,44.5 | 43,28 v46,28 | 61.5,6.5 63.31,4.69 U$8.SDA
  Bottom 0.305: 32.5,30.5 32.5,29 33.5,28 43,28 | 32.5,30.5 32.5,32.5 27.5,37.5 27.5,42 25,44.5 v22,44.5 | v44.5,19 44.5,2.5 U$7.SDA | v53.5,6.5 61.5,6.5 | v33,30.5 32.5,30.5
TX  (via drill 0.5)
  Top 0.3: ATMEGA.21 19.7,29.7 20,30 21,30 21.5,29.5 21.5,28.5 22.5,27.5 28,27.5 | R4.1 47,52.5 43,48.5 v43,44.5 41.7,43.2 U$2.J2-P29
  Top 0.305: 28,27.5 31,30.5 31,37 v30,38
  Bottom 0.3: v30,38 35,43 41.5,43 v43,44.5
UCAP
  Top 0.406: ATMEGA.6 10,34.5 8,34.5 C7.1
UVLO
  Bottom 0.305: R6.2 R3.1 C11.2 25,30.5 U2.7
V_BATT
  Bottom 0.6: MCP73831.3 13.75,47.4 R14.2 R15.2 | JP2.2 10.6,54.2 C10.1 9.5,48.9 R15.2 | R15.2 8.6,47.4 8,46.8 8,45.5 7.5,45 4.5,45 | 4.5,45 4.1,45.4 R11.1 4.05,46.55 MAX16054.6 | 4.5,45 3.9,44.4 Q2.3
V_CTRL  (via drill 0.9)
  Top 0.61: v7,47.7 7,43.7 v7.7,43
  Bottom 0.5: v7,47.7 5.9,46.6 R11.2
  Bottom 0.61: MAX16054.5 5,47.5 R11.2 6,46.5 | v7.7,43 6.5,43 Q2.1
VCC  (via drill 0.9)
  Top 0.4: L1.1 7,41.5 5.9,40.4 C1.1 6.7,37.7 ATMEGA.2 11.8,37.7 13.5,36 13.6,35.9 14.1,35.4 | 14.1,35.4 ATMEGA.14 14.1,27.1 13,26 12.6,25.6 R10.2 8.3,25.6 D2.C | 14.1,35.4 17.9,35.4 19,36.5 20.5,38 ATMEGA.34 20.5,41 24.5,45 31.5,45 37,50.5 37,62.92 FER.1 38.35,64.27 U$1.3 33.3,64.27 U$1.4 | D2.C 5.3,24.8 5,24.5 | v5,24 5,17.5 13.57,8.93 4050D.1 21,8.87 v21,3 31,3 40,12 44,12 45.83,13.82 45.83,14 | v5,24 5,24.5 | C2.1 9.1,23.2 D2.C | DS3231.2 45.83,14 | U$8.V+ U$7.VDD 57.63,6.87 | 57.63,6.87 51,13.5 50.5,14 45.83,14 | 57.63,6.87 59.76,9 68.5,9 72.5,13 72.5,23.5 72.5,25.5 73.5,26.5 73.66,26.66 U$6.VCC | v5,24 5,24.5
  Bottom 0.2: 7.5,25.91 U$9.P$11 U$9.P$10
  Bottom 0.4: 7.2,24.5 6.6,23.9 C21.1 C23.1 | 7.2,24.5 D2.C | D2.C 7.5,25.91 | 7.2,24.5 D2.C | U4.4 25.86,3.86 25,3 v21,3 | 7.2,24.5 5.5,24.5 v5,24
VEE  (via drill 0.5)
  Top 0.3: DS3231.14 47.09,30.09 49,32 | MT3339.P$4 51.75,60.75 50.5,59.5 50.5,58.5 | 50.5,58.5 v50.5,57 | C14.1 50.4,58.6 50.5,58.5
  Top 0.305: v50.5,57 49,55.5 49,32
  Bottom 0.305: CR2032.+$2 29,61.5 33.5,66 50,66 54.5,61.5 CR2032.+$1 v50.5,57
VIN
  Bottom 0.2: U$9.P$6 7.39,29.39 7.5,29.5 7.5,28.98 U$9.P$7 | U$9.P$14 6.2,26.2 6,26
  Bottom 0.3: U2.8 26,30 27,29 29,29 29,29.5 29,32.4 R3.2 | U2.5 21,31
  Bottom 0.4: C19.1 6.6,30.9 7.5,30 7.5,29.5 7.5,29.08 | 20.5,31 21,31 | 6,26 6,25.82 U$9.P$15
  Bottom 0.5: Q2.2 6.1,38 | 6.1,38 6.1,35.5 | 6.1,35.5 6.1,34 C20.1 | 21.1,35 C16.1 20.88,33.27 20.5,33.27 | 21.1,35 21.1,35.4 18.5,38 6.1,38 | L2.P$2 20.5,33.27 | 6.1,35.5 4,35.5 2,33.5 2,27.5 3.48,26.02 U$9.P$15 | 20.5,33.27 20.5,31.5 20.5,31 | 21.1,35 24,35 25.6,33.4 C11.1 R3.2
  Bottom 0.61: C20.1 C19.1
VUSB  (via drill 0.9)
  Top 0.3: ATMEGA.7 9.2,33.7 8.5,33 3.5,33 1,35.5 1,56 9.5,64.5 12.5,64.5 12.8,64.2 X1.VBUS
  Top 0.5: X1.VBUS 17.15,62.85 | 17.15,62.85 18,62 v18,55.5 | 17.15,62.85 18,63.7 D4.A
  Bottom 0.5: C9.1 v18,55.5 17.55,55.05 MCP73831.4
XTAL1
  Top 0.3: ATMEGA.17 16.5,27.5 17.5,26.5 17.9,26.1 R1.1 17.9,22.68 Y1.1
  Top 0.305: Y1.1 21.5,22.5 C4.1
XTAL2
  Top 0.3: ATMEGA.16 15.7,26.3 16,26 16.1,25.9 R1.2 17,24.1 17,23 17,21.73 Y1.3
  Top 0.305: Y1.3 13.5,20.5 C3.2